# EAGLE design VCO (EAGLE 6.6.0)
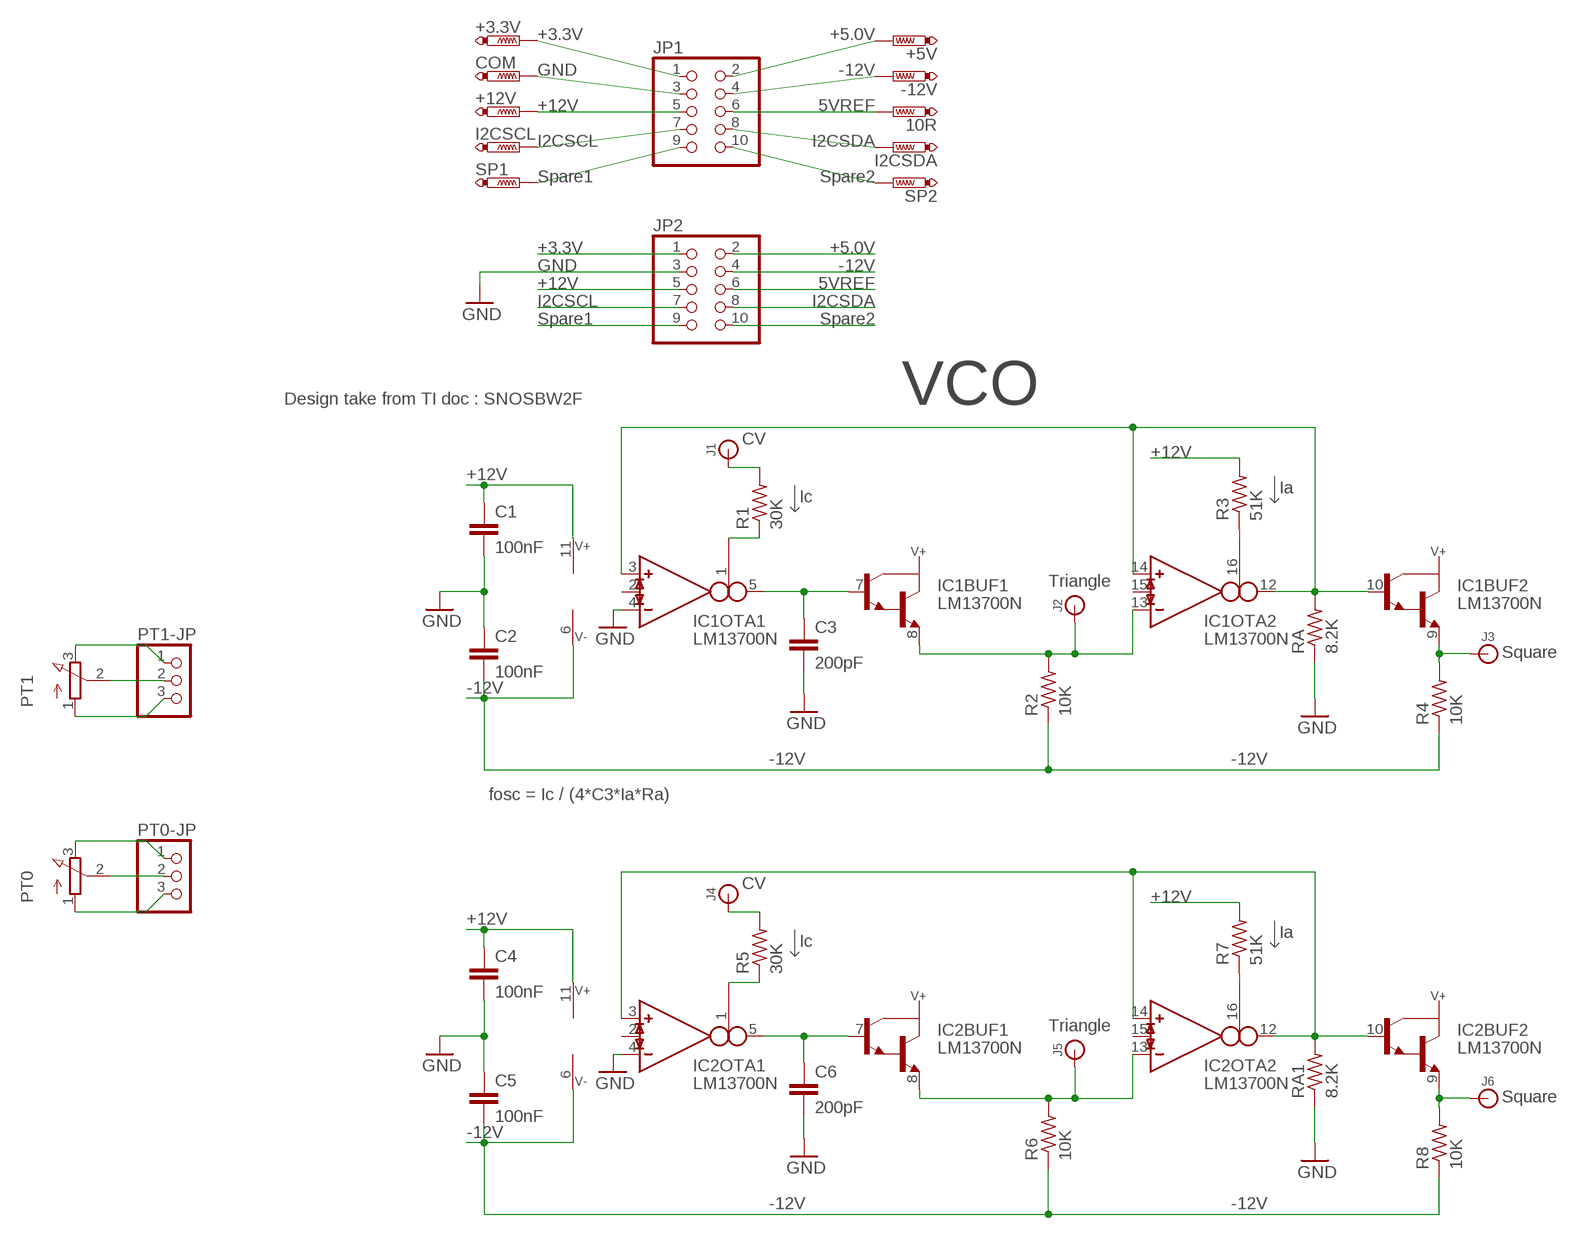
[diagram p0: schematic, sheet 1]

## Parts
10R  PTR1B1,27  [B1,27]
+3.3V  PTR1B1,27  [B1,27]
+5V  PTR1B1,27  [B1,27]
+12V  PTR1B1,27  [B1,27]
-12V  PTR1B1,27  [B1,27]
C1  100nF  C5/2.5  [C5B2.5]
C2  100nF  C5/2.5  [C5B2.5]
C3  200pF  C5/2.5  [C5B2.5]
C4  100nF  C5/2.5  [C5B2.5]
C5  100nF  C5/2.5  [C5B2.5]
C6  200pF  C5/2.5  [C5B2.5]
COM  PTR1B1,27  [B1,27]
I2CSCL  PTR1B1,27  [B1,27]
I2CSDA  PTR1B1,27  [B1,27]
IC1  LM13700N  [DIL16]
IC2  LM13700N  [DIL16]
J1  BANANA_CONN  [BANANA_CONN]
J2  BANANA_CONN  [BANANA_CONN]
J3  BANANA_CONN  [BANANA_CONN]
J4  BANANA_CONN  [BANANA_CONN]
J5  BANANA_CONN  [BANANA_CONN]
J6  BANANA_CONN  [BANANA_CONN]
JP1  PINHD-2X5/90  [2X05/90]
JP2  PINHD-2X5/90  [2X05/90]
PT0  3RP/1610N  [3RP/1610N]
PT0-JP  PINHD-1X3  [1X03]
PT1  3RP/1610N  [3RP/1610N]
PT1-JP  PINHD-1X3  [1X03]
R1  30K  R-US_0207/10  [0207/10]
R2  10K  R-US_0207/10  [0207/10]
R3  51K  R-US_0207/10  [0207/10]
R4  10K  R-US_0207/10  [0207/10]
R5  30K  R-US_0207/10  [0207/10]
R6  10K  R-US_0207/10  [0207/10]
R7  51K  R-US_0207/10  [0207/10]
R8  10K  R-US_0207/10  [0207/10]
RA  8.2K  R-US_0207/10  [0207/10]
RA1  8.2K  R-US_0207/10  [0207/10]
SP1  PTR1B1,27  [B1,27]
SP2  PTR1B1,27  [B1,27]

## Nets
5VREF: 10R.TP JP1.6 JP2.6
+3.3V: +3.3V.TP JP1.1 JP2.1
+5.0V: +5V.TP JP1.2 JP2.2
+12V: +12V.TP C1.1 C4.1 IC1.11(SUPPLY:V+) IC2.11(SUPPLY:V+) JP1.5 JP2.5 R3.2 R7.2
-12V: -12V.TP C2.2 C5.2 IC1.6(SUPPLY:V-) IC2.6(SUPPLY:V-) JP1.4 JP2.4 R2.1 R4.1 R6.1 R8.1
CV: J1.P$1 R1.2
CV1: J4.P$1 R5.2
GND: C1.2 C2.1 C3.2 C4.2 C5.1 C6.2 COM.TP IC1.4(OTA1:IN_N) IC2.4(OTA1:IN_N) JP1.3 JP2.3 RA1.1 RA.1
I2CSCL: I2CSCL.TP JP1.7 JP2.7
I2CSDA: I2CSDA.TP JP1.8 JP2.8
N$1: C3.1 IC1.5(OTA1:OUT) IC1.7(BUF1:B)
N$2: IC1.1(OTA1:I_BIAS) R1.1
N$3: C6.1 IC2.5(OTA1:OUT) IC2.7(BUF1:B)
N$4: IC1.16(OTA2:I_BIAS) R3.1
N$5: IC2.1(OTA1:I_BIAS) R5.1
N$6: IC1.3(OTA1:IN_P) IC1.10(BUF2:B) IC1.12(OTA2:OUT) IC1.14(OTA2:IN_P) RA.2
N$7: IC2.3(OTA1:IN_P) IC2.10(BUF2:B) IC2.12(OTA2:OUT) IC2.14(OTA2:IN_P) RA1.2
N$8: IC2.16(OTA2:I_BIAS) R7.1
N$9: PT1-JP.2 PT1.2(S)
N$10: PT1-JP.1 PT1.3(E)
N$11: PT1-JP.3 PT1.1(A)
N$12: PT0-JP.2 PT0.2(S)
N$13: PT0-JP.1 PT0.3(E)
N$14: PT0-JP.3 PT0.1(A)
SPARE1: JP1.9 JP2.9 SP1.TP
SPARE2: JP1.10 JP2.10 SP2.TP
SQ: IC1.9(BUF2:E) J3.P$1 R4.2
SQ1: IC2.9(BUF2:E) J6.P$1 R8.2
TRI: IC1.8(BUF1:E) IC1.13(OTA2:IN_N) J2.P$1 R2.2
TRI1: IC2.8(BUF1:E) IC2.13(OTA2:IN_N) J5.P$1 R6.2
Unconnected: IC1.2(OTA1:I_DIODE) IC1.15(OTA2:I_DIODE) IC2.2(OTA1:I_DIODE) IC2.15(OTA2:I_DIODE)

## Notes on the sheet
- +3.3V | +5.0V
- GND | -12V
- +12V | 5VREF
- I2CSCL | I2CSDA
- Spare1 | Spare2
- +3.3V | +5.0V
- GND | -12V
- +12V | 5VREF
- I2CSCL | I2CSDA
- Spare1 | Spare2
- Design take from TI doc : SNOSBW2F | VCO
- CV
- +12V
- +12V
- Ia
- Ic
- Triangle
- Square
- -12V
- -12V | -12V
- fosc = Ic / (4*C3*Ia*Ra)
- CV
- +12V
- +12V
- Ia
- Ic
- Triangle
- Square
- -12V
- -12V | -12V

## Library data of the parts
10R +3.3V +5V +12V -12V COM I2CSCL I2CSDA SP1 SP2 = testpad:PTR1: TEST PIN
C1-C6 = capacitor-wima:C: CAPACITOR naming: grid - package width
IC1 IC2 = ota:LM13700: Dual OTA with buffers
J1-J6 = SparkFun-Connectors:BANANA_CONN: Through-hole banana jack
JP1 JP2 = pinhead+:PINHD-2X5: PIN HEADER
PT0 PT1 = pot:3RP/1610N: 16mm Potentiometer one level Source: http://www.alphapotentiometers.net/html/16mm_pot_2.html
PT0-JP PT1-JP = pinhead:PINHD-1X3: PIN HEADER
R1-R8 RA RA1 = resistor:R-US_: RESISTOR, American symbol

## Board
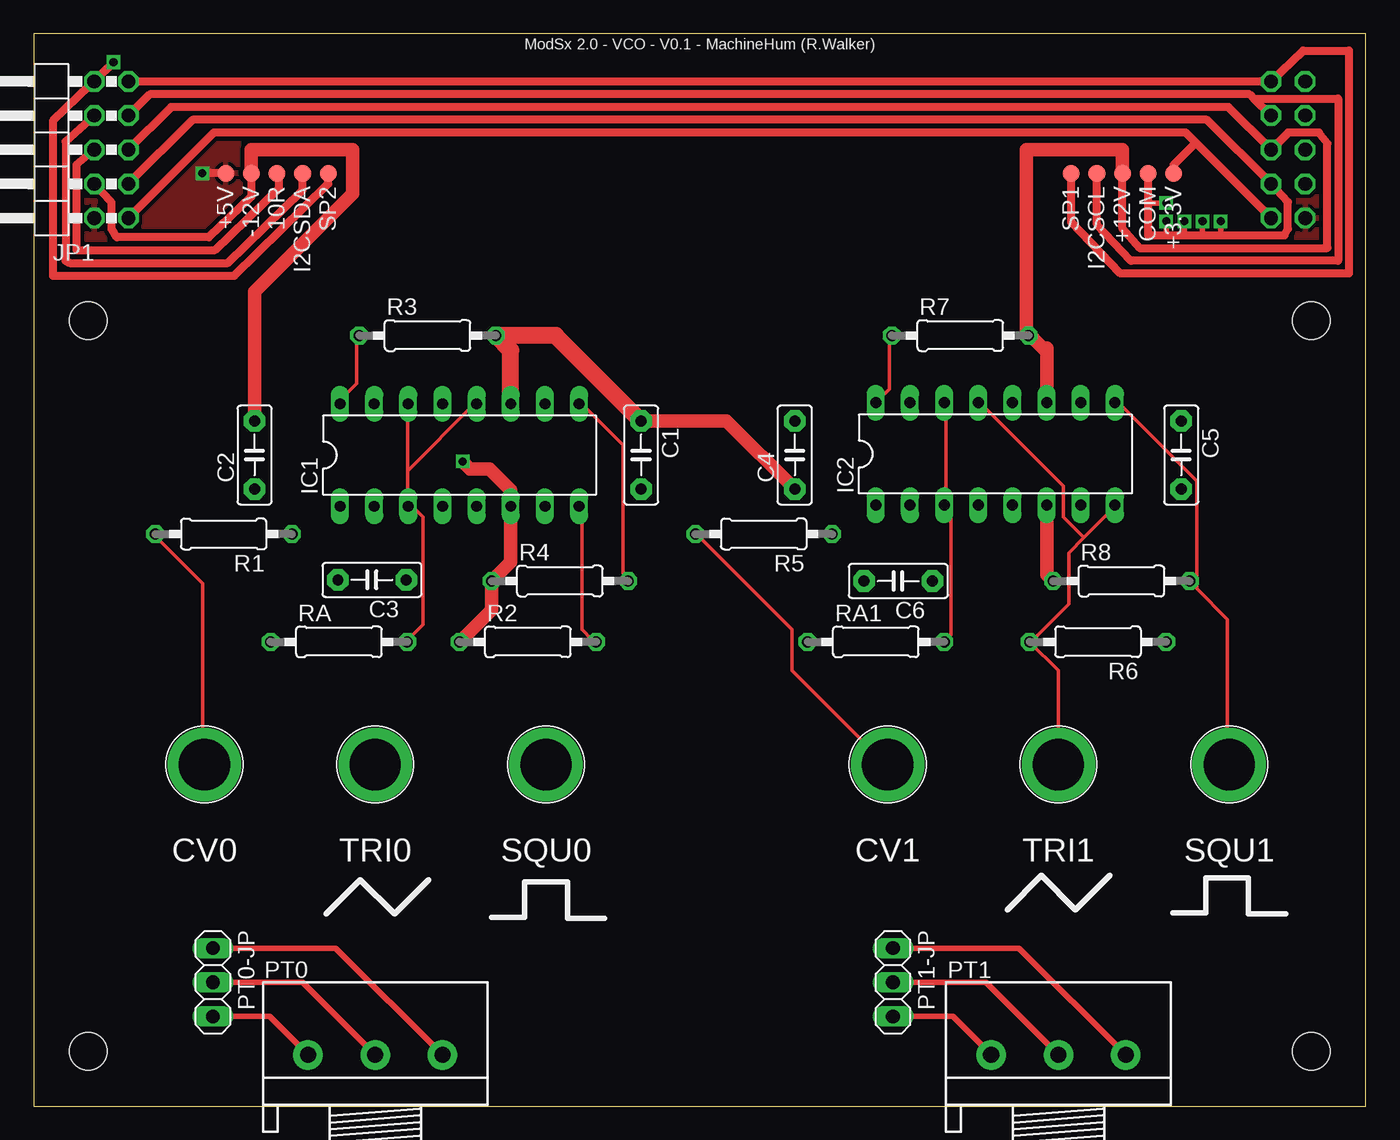
[diagram p1: board, top side]
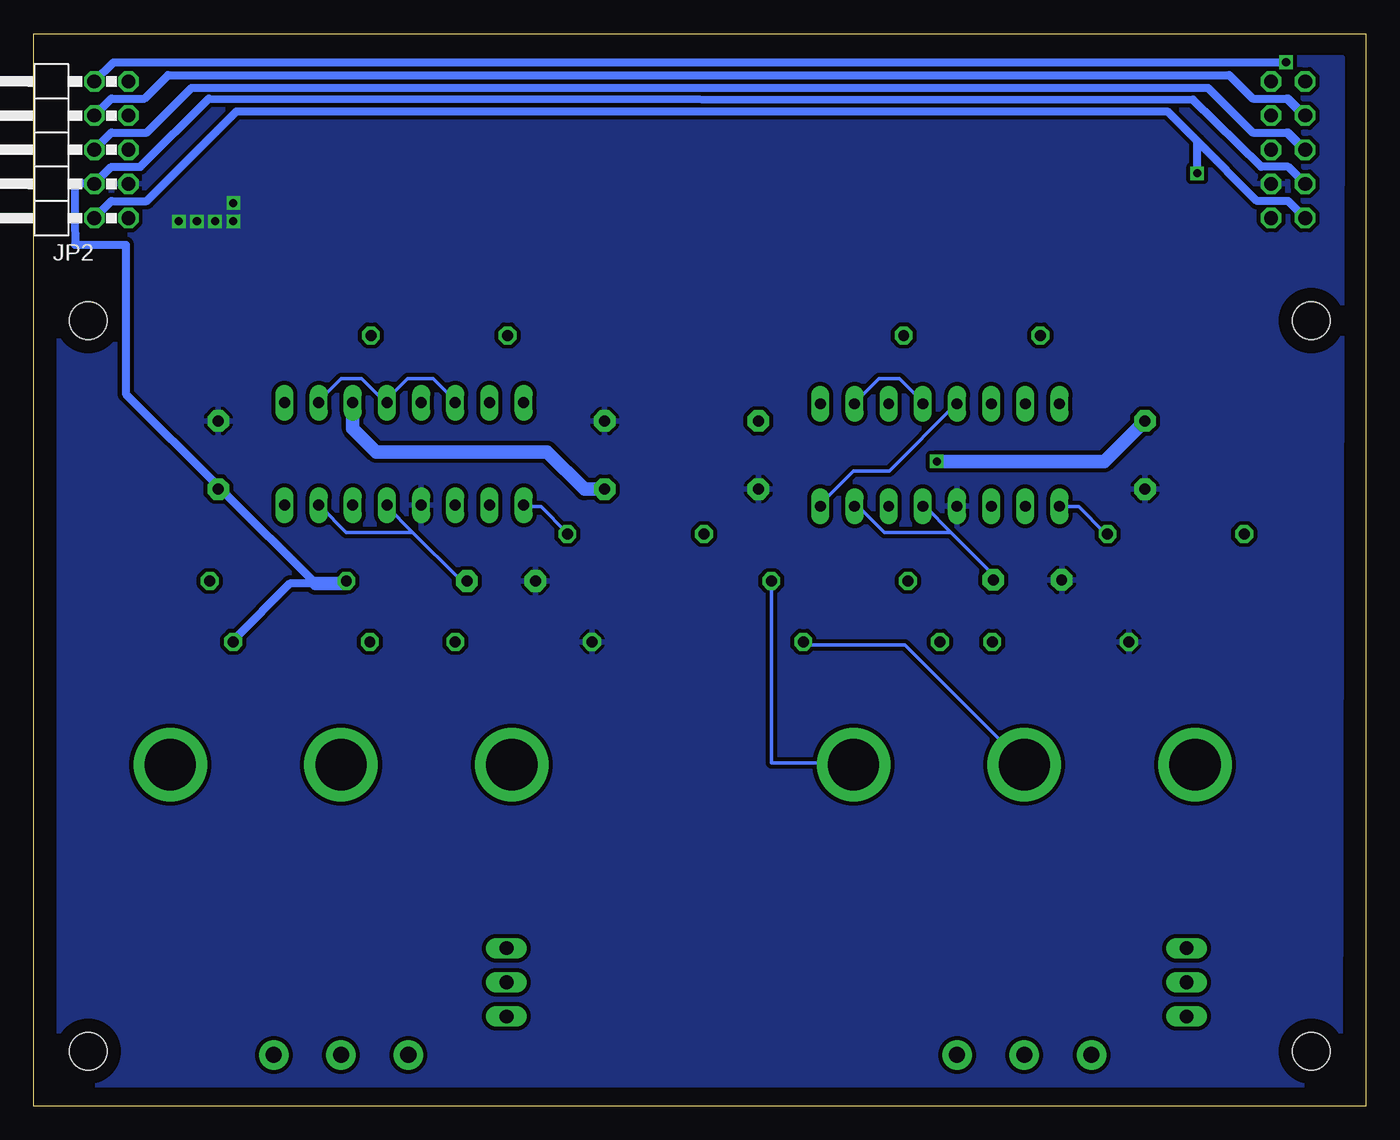
[diagram p2: board, bottom side, seen from below]

Size 99.06 x 79.76 mm. Coordinates in mm from the lower left corner, seen from the top.
Outline: 0,0 99.06,0 99.06,79.76 0,79.76 0,0
Copper layers (1*16): Top 0.035mm / dielectric 1.5mm / Bottom 0.035mm
Design rules "default": minimum track width 10mil, minimum drill 24mil, track to track 8mil, track to pad 8mil, pad to pad 8mil, via to via 8mil, smd to smd 8mil, copper to edge 40mil, drill to drill 8mil, minimum pad ring 10mil, minimum via ring 8mil, stop-mask expansion 4mil, vias tented up to drill 0mil, thermal gap 10mil
Holes 2.8 mm at 4.06,58.42 95,58.42 4.06,4.06 95,4.06

### Footprints (pad centres in the part's own frame; a part is rotated, then mirrored left to right if it is on the bottom)
B1,27 = smd 1.27 x 1.27: TP 0,0
C5B2.5 = drill 0.813 pad 1.6 octagon: 1 -2.54,0; 2 2.54,0
DIL16 = drill 0.813 long: 1 -8.89,-3.81; 2 -6.35,-3.81; 3 -3.81,-3.81; 4 -1.27,-3.81; 5 1.27,-3.81; 6 3.81,-3.81; 7 6.35,-3.81; 8 8.89,-3.81; 9 8.89,3.81; 10 6.35,3.81; 11 3.81,3.81; 12 1.27,3.81; 13 -1.27,3.81; 14 -3.81,3.81; 15 -6.35,3.81; 16 -8.89,3.81
BANANA_CONN = drill 3.81 pad 5.461: P$1 0,0
2X05/90 = drill 1.016 octagon: 1 -5.08,-6.35; 2 -5.08,-3.81; 3 -2.54,-6.35; 4 -2.54,-3.81; 5 0,-6.35; 6 0,-3.81; 7 2.54,-6.35; 8 2.54,-3.81; 9 5.08,-6.35; 10 5.08,-3.81
3RP/1610N = drill 1.2 pad 2.184: 1 -5,0; 2 0,0; 3 5,0
1X03 = drill 1.016 long: 1 -2.54,0; 2 0,0; 3 2.54,0
0207/10 = drill 0.813 octagon: 1 -5.08,0; 2 5.08,0

### Placement (x,y rotation side)
10R  18.1,69.37 270 top
+3.3V  84.77,69.37 270 top
+5V  14.29,69.37 270 top
+12V  80.96,69.37 270 top
-12V  16.19,69.37 270 top
C1  45.16,48.42 270 top
C2  16.43,48.42 90 top
C3  25.16,39.13 180 top
C4  56.59,48.42 90 top
C5  85.33,48.42 270 top
C6  64.29,39.05 180 top
COM  82.87,69.37 270 top
I2CSCL  79.06,69.37 270 top
I2CSDA  20,69.37 270 top
IC1  31.67,48.42 0 top
IC2  71.52,48.5 0 top
J1  12.7,25.4 0 top
J2  25.4,25.4 0 top
J3  38.1,25.4 0 top
J4  63.5,25.4 0 top
J5  76.2,25.4 0 top
J6  88.9,25.4 0 top
JP1  0.7,71.12 90 top
JP2  98.36,71.12 90 bottom
PT0  25.4,3.81 0 top
PT0-JP  13.34,9.21 270 top
PT1  76.2,3.81 0 top
PT1-JP  63.9,9.21 270 top
R1  14.13,42.55 180 top
R2  36.75,34.53 0 top
R3  29.29,57.31 0 top
R4  39.13,39.05 0 top
R5  54.29,42.55 180 top
R6  79.14,34.53 180 top
R7  68.9,57.31 0 top
R8  80.88,39.05 0 top
RA  22.7,34.53 0 top
RA1  62.63,34.53 0 top
SP1  77.15,69.37 270 top
SP2  21.91,69.37 270 top

### Tracks (layer width: path | path; a pad name or v marks a point on that pad's centre or on a via)
5VREF
  Top 0.61: 10R.TP 18.26,69.22 18.26,68.26 13.49,63.66 3.17,63.66 3.17,70.01 JP1.6
  Bottom 0.61: JP1.6 5.78,72.39 5.87,72.39 | JP2.6 93.28,72.39 90.65,72.39 87.31,75.72 11.75,75.72 8.41,72.39 5.87,72.39 | 5.87,72.39 4.6,71.12
+3.3V
  Top 0.61: JP1.1 13.4,72.39 85.66,72.39 86.41,71.64 | JP2.1 86.41,71.64 | +3.3V.TP 84.77,70.01 86.41,71.64
+5.0V  (via drill 0.6)
  Top 0.61: +5V.TP v12.54,69.37
  Bottom 0.61: JP1.2 5.78,67.31 8.1,67.31 12.54,71.75 | JP2.2 93.28,67.31 90.65,67.31 83.98,73.98 14.76,73.98 12.54,71.75 | v12.54,69.37 12.54,71.75
  pour Top (isolate 0.305): 1.91,1.59 1.91,4.45 1.75,77.95 97.16,77.95 97.16,1.59
+12V
  Top 0.254: 75.06,56.39 74.3,57.15 R7.2 | 75.06,52.58 IC2.11
  Top 0.61: JP1.5 10.22,74.3 88.84,74.3 JP2.5 93.28,72.39 95.57,72.39 96.2,71.6 96.2,63.82 82.23,63.82 80.96,65.25 +12V.TP
  Top 1.016: +12V.TP 80.96,71.12 73.82,71.12 73.82,57.63 75.06,56.39 75.33,56.39 IC2.11 | C1.1 51.51,50.96 C4.1
  Top 1.27: IC1.11 35.48,56.2 R3.2 38.81,57.31 C1.1
  Bottom 1.016: C4.1 58.1,45.88 60.88,48.66 73.58,48.66 75.33,50.4 IC2.11
-12V  (via drill 0.6)
  Top 0.61: -12V.TP 16.19,67.63 13.02,64.61 6.19,64.61 5.79,65.25 5.79,67.22 JP1.4
  Top 1.016: C2.2 16.43,60.56 23.73,67.87 23.73,71.12 16.19,71.12 -12V.TP | v31.91,47.94 32.46,47.39 33.89,47.39 35.48,45.8 IC1.6 35.48,40.48 R4.1 34.05,36.91 R2.1 | R8.1 75.33,39.53 IC2.6
  Bottom 0.254: 84.2,34.67 R6.1 | 75.82,38.86 R8.1 | 84.96,45.72 C5.2 85.34,46.1
  Bottom 0.61: JP1.4 5.78,69.85 7.78,69.85 12.86,74.85 86.04,74.93 91.12,69.85 93.28,69.85 JP2.4 96.01,68.58 96.01,65.91 95.98,64.06 92.2,64.06 92.2,52.96 85.34,46.1 | 84.2,34.67 80.01,38.86 78.11,38.86 84.96,45.72
  Bottom 1.016: C2.2 19.45,47.94 v31.91,47.94 | 78.11,38.86 75.99,38.86 R8.1
CV
  Top 0.254: R1.2 9.14,42.29 12.57,38.86 12.57,25.53 J1.P$1
CV1
  Top 0.254: R5.2 49.53,42.29 56.39,35.43 56.39,32.38 63.25,25.53 J4.P$1
GND  (via drill 0.6)
  Top 0.406: v84.22,65.8 84.22,64.77 | v85.57,65.8 85.57,64.85 | v86.92,65.8 86.92,64.93 | v88.27,65.8 88.27,64.93 | v84.22,67.15 82.95,67.15
  Top 0.61: JP1.3 11.81,73.34 87.25,73.34 JP2.3 93.27,67.25 93.27,65.25 93.03,64.77 84.22,64.77 82.87,64.77 COM.TP
  pour Bottom (isolate 0.305): 1.91,1.59 1.75,77.95 97.16,77.95 97.16,1.59
I2CSCL
  Top 0.61: JP1.7 8.64,75.25 90.42,75.25 90.74,74.93 | JP2.7 90.74,74.93 | 90.74,74.93 97,74.93 97,62.87 81.6,62.87 79.06,65.56 I2CSCL.TP
I2CSDA
  Top 0.61: I2CSDA.TP 20,68.1 14.45,62.71 2.7,62.71 2.38,62.87 2.38,71.75 JP1.8
  Bottom 0.61: JP1.8 5.78,74.93 5.87,74.93 | JP2.8 93.28,74.93 90.81,74.93 89.06,76.68 10.16,76.68 8.41,74.93 5.87,74.93 | 5.87,74.93 4.6,73.66
N$1
  Bottom 0.254: 30.86,42.67 27.43,39.24 C3.1 | 30.86,42.67 32.77,44.58 IC1.5 | 30.86,42.67 35.81,42.67 37.72,44.58 IC1.7
N$2
  Bottom 0.254: R1.1 19.43,42.67 21.34,44.58 22.48,44.58 IC1.1
N$3
  Bottom 0.254: 70.87,42.67 67.44,39.24 67.06,39.24 C6.1 | 70.87,42.67 72.77,44.58 IC2.5 | 70.87,42.67 75.82,42.67 77.72,44.58 IC2.7
N$4
  Top 0.254: IC1.16 22.86,52.58 24,53.72 24,57.15 R3.1
N$5
  Bottom 0.254: R5.1 59.44,42.67 61.34,44.58 62.48,44.58 IC2.1
N$6
  Top 0.254: RA.2 27.81,34.67 28.96,35.81 28.96,43.81 28.19,44.58 IC1.3 27.81,44.96 27.81,47.24 | 27.81,47.24 27.81,52.2 IC1.14 | 27.81,47.24 32.77,52.2 IC1.12
  Bottom 0.254: IC1.10 37.72,52.58 36.2,54.1 34.67,54.1 33.15,52.58 IC1.12
N$7
  Top 0.254: RA1.2 67.82,34.67 68.2,35.05 68.2,44.2 IC2.3 67.82,44.96 67.82,52.2 IC2.14
  Bottom 0.254: IC2.10 77.72,52.58 76.2,54.1 74.68,54.1 73.15,52.58 IC2.12 72.77,52.58 71.25,54.1 69.34,54.1 67.82,52.58 IC2.14
N$8
  Top 0.254: IC2.16 62.87,52.58 63.63,53.34 63.63,57.15 R7.1
N$9
  Top 0.406: PT1-JP.2 70.8,9.21 PT1.2
N$10
  Top 0.406: PT1-JP.1 73.26,11.75 PT1.3
N$11
  Top 0.406: PT1-JP.3 68.34,6.67 PT1.1
N$12
  Top 0.406: PT0-JP.2 20,9.21 PT0.2
N$13
  Top 0.406: PT0-JP.1 22.46,11.75 PT0.3
N$14
  Top 0.406: PT0-JP.3 17.54,6.67 PT0.1
SPARE1
  Top 0.61: JP1.9 JP2.9 94.39,78.5 97.79,78.5 97.79,61.91 80.8,61.91 77.15,65.72 SP1.TP
SPARE2  (via drill 0.6)
  Top 0.61: SP2.TP 21.91,68.58 14.92,61.75 1.43,61.75 1.43,73.28 v5.94,77.63 JP1.10
  Bottom 0.61: JP2.10 93.12,77.63 v5.94,77.63
SQ
  Top 0.254: IC1.9 40.77,52.2 43.81,49.15 43.81,39.62 44.2,39.24 R4.2
  Bottom 0.254: R4.2 44.2,38.86 44.2,25.53 38.1,25.53 J3.P$1
SQ1
  Top 0.254: 86.49,38.48 88.77,36.2 88.77,25.53 J6.P$1 | 86.49,38.48 86.11,38.86 R8.2 | 86.49,38.48 86.49,46.48 80.77,52.2 IC2.9
TRI
  Top 0.254: R2.2 41.53,34.67 40.77,35.43 40.77,44.58 IC1.8
  Bottom 0.254: IC1.13 30.48,52.2 35.43,47.24 38.1,47.24 40.39,44.96 IC1.8 | J2.P$1 34.29,34.29 41.53,34.29 R2.2
TRI1
  Top 0.254: J5.P$1 76.2,32.38 R6.2 74.3,34.67 76.96,37.34 76.96,41.15 78.11,42.29 | 78.11,42.29 80.39,44.58 IC2.8 | 78.11,42.29 76.58,43.81 76.58,46.1 70.48,52.2 IC2.13

### Text on the board
tPlace: ModSx 2.0 - VCO - V0.1 - MachineHum (R.Walker) | CV0 | TRI0 | SQU0 | CV1 | TRI1 | SQU1